# EAGLE schematic h bridge (EAGLE 9.6.2)

## Sheet 1 of 2
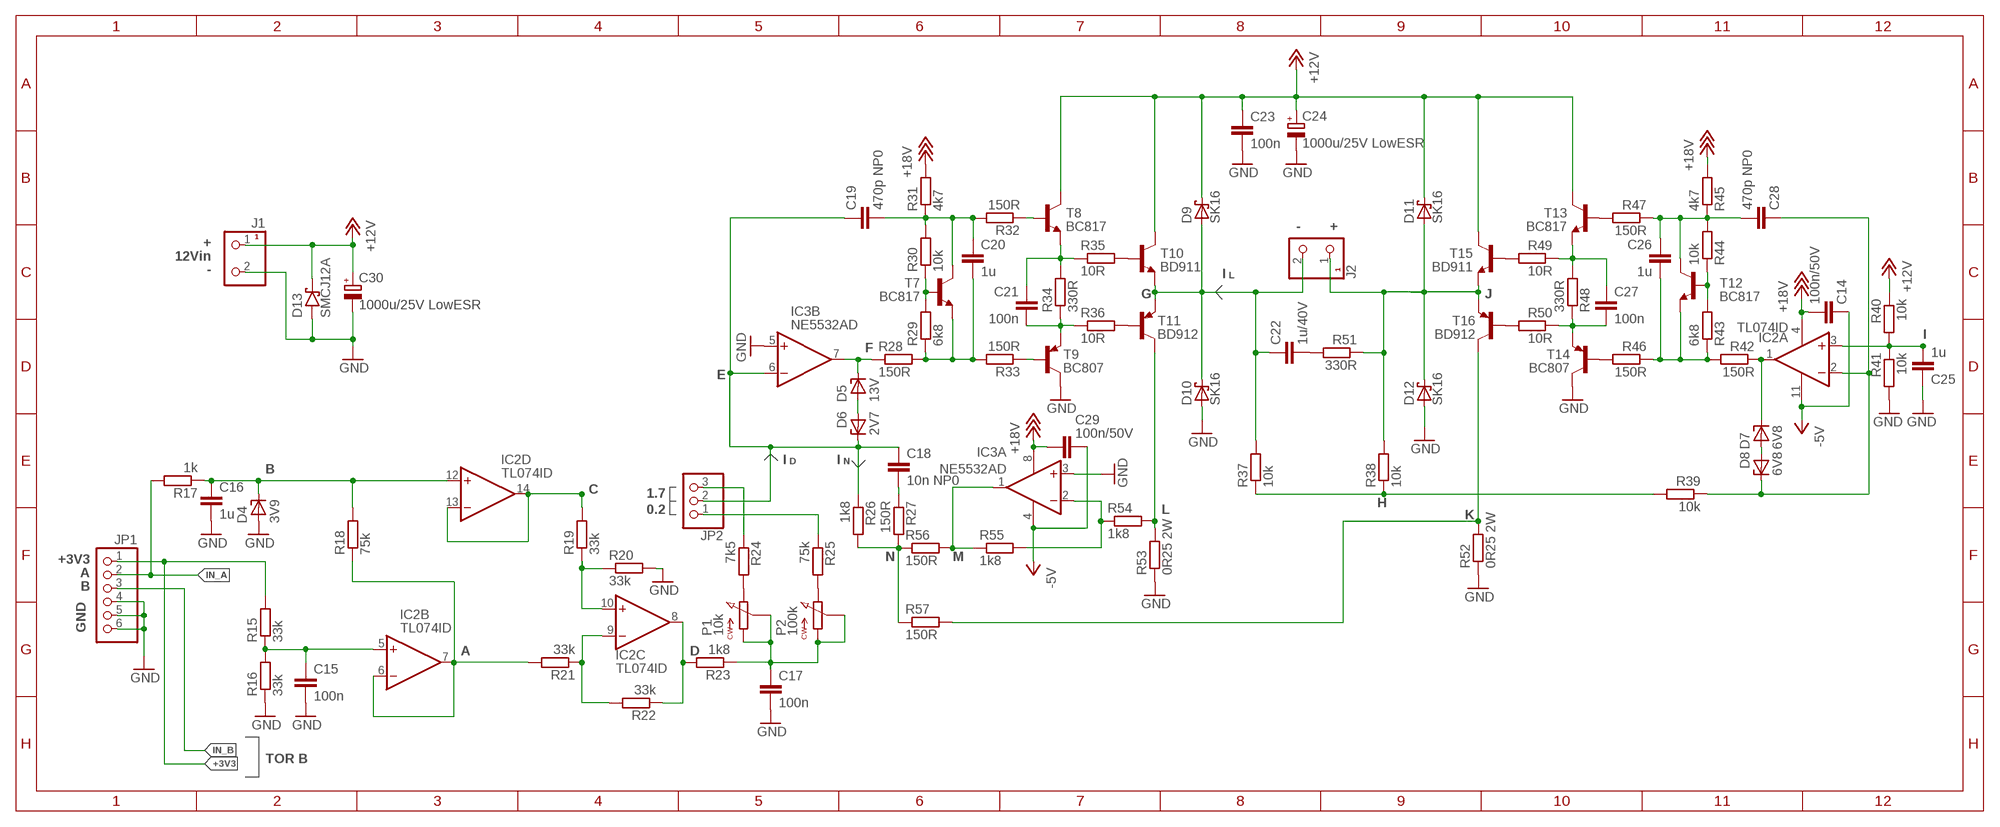
[diagram p0: schematic, sheet 1]

### Parts
C14  100n/50V  C-SMD-1206  [1206-SMD]
C15  100n  C-SMD-0805  [0805-SMD]
C16  1u  C-SMD-0805  [0805-SMD]
C17  100n  C-SMD-0805  [0805-SMD]
C18  10n NP0  C-SMD-0805  [0805-SMD]
C19  470p NP0  C-SMD-0805  [0805-SMD]
C20  1u  C-SMD-0805  [0805-SMD]
C21  100n  C-SMD-0805  [0805-SMD]
C22  1u/40V  C-THT-5MM-7.2X7.2  [FOIL-CAP-WIMA-7.2X7.2]
C23  100n  C-SMD-0805  [0805-SMD]
C24  1000u/25V LowESR  CPOL-THT-13MM  [CAP-THT-13MM-5MM]
C25  1u  C-SMD-0805  [0805-SMD]
C26  1u  C-SMD-0805  [0805-SMD]
C27  100n  C-SMD-0805  [0805-SMD]
C28  470p NP0  C-SMD-0805  [0805-SMD]
C29  100n/50V  C-SMD-1206  [1206-SMD]
C30  1000u/25V LowESR  CPOL-THT-13MM  [CAP-THT-13MM-5MM]
D4  3V9  DIODE-ZENER-SMD-MINI-MELF  [DIODE-MINI-MELF]
D5  13V  DIODE-ZENER-SMD-MINI-MELF  [DIODE-MINI-MELF]
D6  2V7  DIODE-ZENER-SMD-MINI-MELF  [DIODE-MINI-MELF]
D7  6V8  DIODE-ZENER-SMD-MINI-MELF  [DIODE-MINI-MELF]
D8  6V8  DIODE-ZENER-SMD-MINI-MELF  [DIODE-MINI-MELF]
D9  SK16  DIODE-SCHOTTKY-SMA  [DIODE-DO214AC-SMA-M]
D10  SK16  DIODE-SCHOTTKY-SMA  [DIODE-DO214AC-SMA-M]
D11  SK16  DIODE-SCHOTTKY-SMA  [DIODE-DO214AC-SMA-M]
D12  SK16  DIODE-SCHOTTKY-SMA  [DIODE-DO214AC-SMA-M]
D13  SMCJ12A  DIODE-TRANSIL-UNIDIR-SINGLE-SMC  [DIODE-DO214AB-SMC]
IC2  TL074ID  OPAMP_QUAD-SOIC14  [SOIC14-M]
IC3  NE5532AD  OPAMP_DUAL-SOIC8  [SOIC8-M]
J1  DEGSON DG301-5.0-2  ARK-2-THT-5.0MM-DG301  [ARK-2-DG301-5MM]
J2  DEGSON DG301-5.0-2  ARK-2-THT-5.0MM-DG301  [ARK-2-DG301-5MM]
JP1  CONNFLY DS1021-1*6SF1-1  PINHD-1X6  [1X06]
JP2  (1/2) CONNFLY DS1021-1*6SF1-1  PINHD-1X3  [1X03]
P1  10k  POT-THT-H  [POT-H]
P2  100k  POT-THT-H  [POT-H]
R15  33k  R-SMD-0805  [0805-SMD]
R16  33k  R-SMD-0805  [0805-SMD]
R17  1k  R-SMD-0805  [0805-SMD]
R18  75k  R-SMD-0805  [0805-SMD]
R19  33k  R-SMD-0805  [0805-SMD]
R20  33k  R-SMD-0805  [0805-SMD]
R21  33k  R-SMD-0805  [0805-SMD]
R22  33k  R-SMD-0805  [0805-SMD]
R23  1k8  R-SMD-0805  [0805-SMD]
R24  7k5  R-SMD-0805  [0805-SMD]
R25  75k  R-SMD-0805  [0805-SMD]
R26  1k8  R-SMD-0805  [0805-SMD]
R27  150R  R-SMD-0805  [0805-SMD]
R28  150R  R-SMD-0805  [0805-SMD]
R29  6k8  R-SMD-0805  [0805-SMD]
R30  10k  R-SMD-0805  [0805-SMD]
R31  4k7  R-SMD-0805  [0805-SMD]
R32  150R  R-SMD-0805  [0805-SMD]
R33  150R  R-SMD-0805  [0805-SMD]
R34  330R  R-SMD-0805  [0805-SMD]
R35  10R  R-SMD-0805  [0805-SMD]
R36  10R  R-SMD-0805  [0805-SMD]
R37  10k  R-SMD-0805  [0805-SMD]
R38  10k  R-SMD-0805  [0805-SMD]
R39  10k  R-SMD-0805  [0805-SMD]
R40  10k  R-SMD-0805  [0805-SMD]
R41  10k  R-SMD-0805  [0805-SMD]
R42  150R  R-SMD-0805  [0805-SMD]
R43  6k8  R-SMD-0805  [0805-SMD]
R44  10k  R-SMD-0805  [0805-SMD]
R45  4k7  R-SMD-0805  [0805-SMD]
R46  150R  R-SMD-0805  [0805-SMD]
R47  150R  R-SMD-0805  [0805-SMD]
R48  330R  R-SMD-0805  [0805-SMD]
R49  10R  R-SMD-0805  [0805-SMD]
R50  10R  R-SMD-0805  [0805-SMD]
R51  330R  R-SMD-0805  [0805-SMD]
R52  0R25 2W  R-SMD-2512  [2512-SMD]
R53  0R25 2W  R-SMD-2512  [2512-SMD]
R54  1k8  R-SMD-0805  [0805-SMD]
R55  1k8  R-SMD-0805  [0805-SMD]
R56  150R  R-SMD-0805  [0805-SMD]
R57  150R  R-SMD-0805  [0805-SMD]
T7  BC817  TRANSISTOR-NPN-SMD-SOT23  [SOT23]
T8  BC817  TRANSISTOR-NPN-SMD-SOT23  [SOT23]
T9  BC807  TRANSISTOR-PNP-SMD-SOT23  [SOT23]
T10  BD911  TRANSISTOR-NPN-SMD-SOT23  [SOT23]
T11  BD912  TRANSISTOR-PNP-SMD-SOT23  [SOT23]
T12  BC817  TRANSISTOR-NPN-SMD-SOT23  [SOT23]
T13  BC817  TRANSISTOR-NPN-SMD-SOT23  [SOT23]
T14  BC807  TRANSISTOR-PNP-SMD-SOT23  [SOT23]
T15  BD911  TRANSISTOR-NPN-SMD-SOT23  [SOT23]
T16  BD912  TRANSISTOR-PNP-SMD-SOT23  [SOT23]

### Nets
+3V3: JP1.1 R15.P$2
+12V: C23.P$1 C24.POS(+) C30.POS(+) D9.K(C) D11.K(C) D13.K(C) J1.1 R40.P$1 T10.3(C) T13.3(C) T15.3(C) ; also sheet 2
+18V: C14.P$2 C29.P$2 IC2.4(A:V+) IC3.8(A:V+) R31.P$2 R45.P$2 ; also sheet 2
-5V: C14.P$1 C29.P$1 IC2.11(A:V-) IC3.4(A:V-) ; also sheet 2
GND: C15.P$2 C16.P$2 C17.P$2 C23.P$2 C24.NEG(-) C25.P$1 C30.NEG(-) D4.A D10.A D12.A D13.A IC3.3(A:+IN) IC3.5(B:+IN) J1.2 JP1.4 JP1.5 JP1.6 R16.P$1 R20.P$2 R41.P$2 R52.P$1 R53.P$1 T9.3(C) T14.3(C) ; also sheet 2
IN_A: JP1.2 R17.P$2
IN_B: JP1.3
N$1: IC2.6(B:-IN) IC2.7(B:OUT) R18.P$1 R21.P$2
N$2: D11.A D12.K(C)
N$3: C18.P$1 C19.P$1 D6.K(C) IC3.6(B:-IN) JP2.2 R26.P$1
N$4: P1.CW R24.P$2
N$5: R47.P$2 T13.1(B)
N$6: R46.P$2 T14.1(B)
N$7: R33.P$1 T9.1(B)
N$8: R32.P$1 T8.1(B)
N$14: JP2.1 R25.P$1
N$15: JP2.3 R24.P$1
N$16: P2.CW R25.P$2
N$17: C22.P$2 R51.P$2
N$492: C15.P$1 IC2.5(B:+IN) R15.P$1 R16.P$2
N$493: C16.P$1 D4.K(C) IC2.12(D:+IN) R17.P$1 R18.P$2
N$496: IC2.13(D:-IN) IC2.14(D:OUT) R19.P$2
N$497: IC2.10(C:+IN) R19.P$1 R20.P$1
N$498: IC2.9(C:-IN) R21.P$1 R22.P$2
N$499: IC2.8(C:OUT) R22.P$1 R23.P$2
N$502: D5.K(C) IC3.7(B:OUT) R28.P$1
N$503: C21.P$1 R34.P$2 R35.P$1 T8.2(E)
N$504: C21.P$2 R34.P$1 R36.P$1 T9.2(E)
N$505: C20.P$2 R28.P$2 R33.P$2 T7.2(E)
N$506: R29.P$2 R30.P$1 T7.1(B)
N$507: T8.3(C)
N$508: R35.P$2 T10.1(B)
N$509: R36.P$2 T11.1(B)
N$510: C22.P$1 D9.A D10.K(C) J2.2 R37.P$2 T10.2(E) T11.2(E)
N$511: D7.K(C) IC2.1(A:OUT) R42.P$1
N$512: C27.P$1 R48.P$2 R49.P$1 T13.2(E)
N$513: C27.P$2 R48.P$1 R50.P$1 T14.2(E)
N$514: C26.P$2 R42.P$2 R43.P$1 R46.P$1 T12.2(E)
N$515: C26.P$1 C28.P$2 R44.P$2 R45.P$1 R47.P$1 T12.3(C)
N$516: R43.P$2 R44.P$1 T12.1(B)
N$517: R49.P$2 T15.1(B)
N$518: R50.P$2 T16.1(B)
N$519: J2.1 R38.P$2 R51.P$1 T15.2(E) T16.2(E)
N$520: C25.P$2 IC2.3(A:+IN) R40.P$2 R41.P$1
N$521: C28.P$1 D8.K(C) IC2.2(A:-IN) R39.P$1
N$522: R53.P$2 R54.P$2 T11.3(C)
N$523: R52.P$2 R57.P$2 T16.3(C)
N$524: IC3.2(A:-IN) R54.P$1 R55.P$2
N$525: IC3.1(A:OUT) R55.P$1 R56.P$2
N$526: R26.P$2 R27.P$2 R56.P$1 R57.P$1
N$527: R37.P$1 R38.P$1 R39.P$2
N$530: C19.P$2 C20.P$1 R30.P$2 R31.P$1 R32.P$2 T7.3(C)
N$531: R29.P$1
N$532: C18.P$2 R27.P$1
N$535: C17.P$1 P1.CCW P1.W P2.CCW P2.W R23.P$1
N$538: D5.A D6.A
N$539: D7.A D8.A

### Notes on the sheet
- - | +
- +
- 12Vin
- -
- I | L
- G | J
- I
- F
- E
- I | D | I | N
- B
- 1.7
- C
- 0.2 | H
- L
- K
- +3V3
- N | M
- A
- B
- GND
- A | D
- TOR B

## Sheet 2 of 2
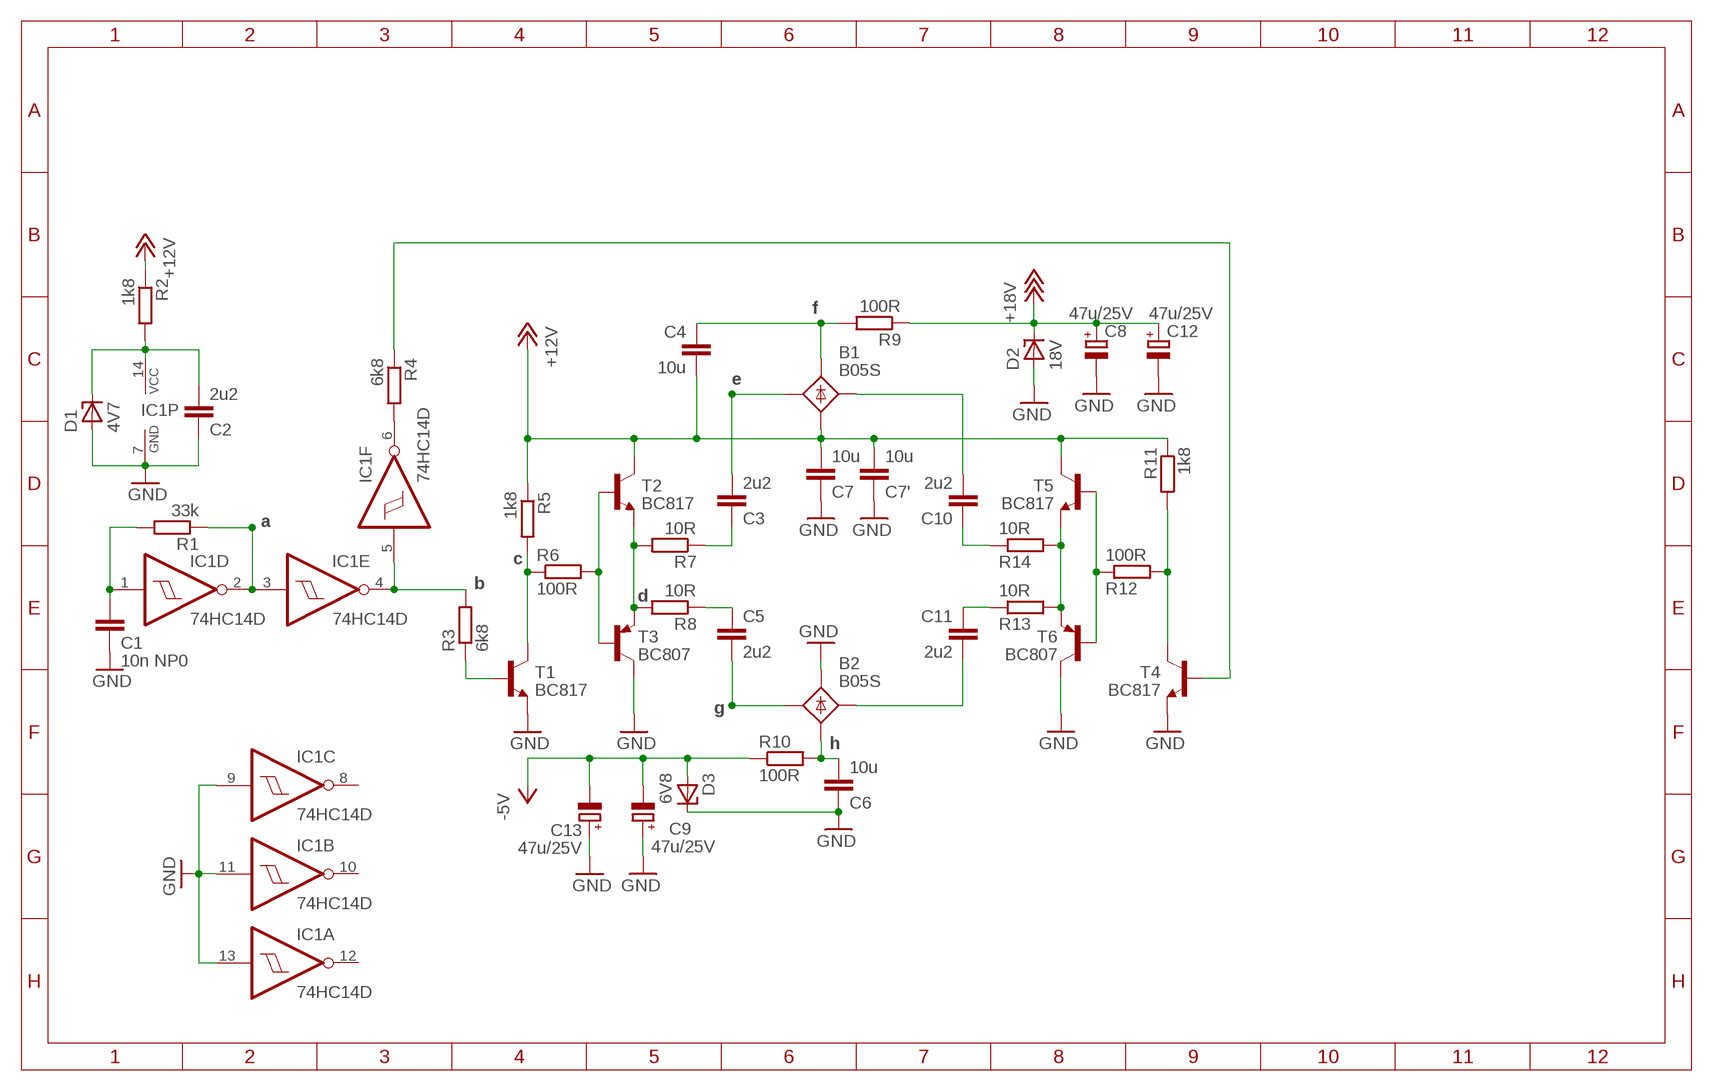
[diagram p1: schematic, sheet 2]

### Parts
B1  B05S  RECTIFIER-DB-1MS  [BRIDGE_DB-1MS]
B2  B05S  RECTIFIER-DB-1MS  [BRIDGE_DB-1MS]
C1  10n NP0  C-SMD-0805  [0805-SMD]
C2  2u2  C-SMD-0805  [0805-SMD]
C3  2u2  C-SMD-0805  [0805-SMD]
C4  10u  C-SMD-0805  [0805-SMD]
C5  2u2  C-SMD-0805  [0805-SMD]
C6  10u  C-SMD-0805  [0805-SMD]
C7  10u  C-SMD-0805  [0805-SMD]
C7'  10u  C-SMD-0805  [0805-SMD]
C8  47u/25V  CPOL-THT-6.3MM  [CAP-THT-6MM-2.5MM]
C9  47u/25V  CPOL-THT-6.3MM  [CAP-THT-6MM-2.5MM]
C10  2u2  C-SMD-0805  [0805-SMD]
C11  2u2  C-SMD-0805  [0805-SMD]
C12  47u/25V  CPOL-THT-6.3MM  [CAP-THT-6MM-2.5MM]
C13  47u/25V  CPOL-THT-6.3MM  [CAP-THT-6MM-2.5MM]
D1  4V7  DIODE-ZENER-SMD-MINI-MELF  [DIODE-MINI-MELF]
D2  18V  DIODE-ZENER-SMD-MINI-MELF  [DIODE-MINI-MELF]
D3  6V8  DIODE-ZENER-SMD-MINI-MELF  [DIODE-MINI-MELF]
IC1  74HC14D  [SO14]
R1  33k  R-SMD-0805  [0805-SMD]
R2  1k8  R-SMD-0805  [0805-SMD]
R3  6k8  R-SMD-0805  [0805-SMD]
R4  6k8  R-SMD-0805  [0805-SMD]
R5  1k8  R-SMD-0805  [0805-SMD]
R6  100R  R-SMD-0805  [0805-SMD]
R7  10R  R-SMD-0805  [0805-SMD]
R8  10R  R-SMD-0805  [0805-SMD]
R9  100R  R-SMD-0805  [0805-SMD]
R10  100R  R-SMD-0805  [0805-SMD]
R11  1k8  R-SMD-0805  [0805-SMD]
R12  100R  R-SMD-0805  [0805-SMD]
R13  10R  R-SMD-0805  [0805-SMD]
R14  10R  R-SMD-0805  [0805-SMD]
T1  BC817  TRANSISTOR-NPN-SMD-SOT23  [SOT23]
T2  BC817  TRANSISTOR-NPN-SMD-SOT23  [SOT23]
T3  BC807  TRANSISTOR-PNP-SMD-SOT23  [SOT23]
T4  BC817  TRANSISTOR-NPN-SMD-SOT23  [SOT23]
T5  BC817  TRANSISTOR-NPN-SMD-SOT23  [SOT23]
T6  BC807  TRANSISTOR-PNP-SMD-SOT23  [SOT23]

### Nets
+12V: B1.NEG(-) C4.P$2 C7'.P$2 C7.P$2 R2.P$1 R5.P$1 R11.P$1 T2.3(C) T5.3(C) ; also sheet 1
+18V: C8.POS(+) C12.POS(+) D2.K(C) R9.P$1 ; also sheet 1
-5V: C9.NEG(-) C13.NEG(-) D3.A R10.P$1 ; also sheet 1
GND: B2.POS(+) C1.P$2 C2.P$1 C6.P$1 C7'.P$1 C7.P$1 C8.NEG(-) C9.POS(+) C12.NEG(-) C13.POS(+) D1.A D2.A D3.K(C) IC1.7(P:GND) IC1.9(C:I) IC1.11(B:I) IC1.13(A:I) T1.2(E) T3.3(C) T4.2(E) T6.3(C) ; also sheet 1
N$9: R5.P$2 R6.P$1 T1.3(C)
N$10: R12.P$1 T5.1(B) T6.1(B)
N$11: IC1.2(D:O) IC1.3(E:I) R1.P$1
N$12: IC1.6(F:O) R4.P$2
N$13: IC1.4(E:O) IC1.5(F:I) R3.P$2
N$541: C1.P$1 IC1.1(D:I) R1.P$2
N$543: R3.P$1 T1.1(B)
N$544: R7.P$2 R8.P$2 T2.2(E) T3.2(E)
N$545: C5.P$1 R8.P$1
N$546: C3.P$1 R7.P$1
N$547: B1.AC1 C3.P$2
N$548: T4.1(B)
N$549: R11.P$2 R12.P$2 T4.3(C)
N$550: R13.P$2 R14.P$2 T5.2(E) T6.2(E)
N$551: C11.P$1 R13.P$1
N$552: C10.P$1 R14.P$1
N$553: B1.AC2 C10.P$2
N$554: B2.AC1 C5.P$2
N$555: B2.AC2 C11.P$2
N$556: B2.NEG(-) C6.P$2 R10.P$2
N$557: B1.POS(+) C4.P$1 R9.P$2
N$558: R4.P$1
N$559: R6.P$2 T2.1(B) T3.1(B)
N$560: C2.P$2 D1.K(C) IC1.14(P:VCC) R2.P$2
Unconnected: IC1.8(C:O) IC1.10(B:O) IC1.12(A:O)

### Notes on the sheet
- f
- e
- a
- c
- b
- d
- g
- h

## Library data of the parts
B1 B2 = Moja2:RECTIFIER: Rectifier, 1 phase
C1-C7 C7' C10 C11 C14-C23 C25-C29 = Moja2:C
C8 C9 C12 C13 C24 C30 = Moja2:CPOL
D1-D8 = Moja2:DIODE-ZENER
D9-D12 = Moja2:DIODE-SCHOTTKY
D13 = Moja2:DIODE-TRANSIL-UNIDIR-SINGLE: General Transil diode
IC1 = 74xx-eu:74*14: Hex schmitt trigger INVERTER
IC2 = Moja2:OPAMP_QUAD
IC3 = Moja2:OPAMP_DUAL
J1 J2 = Moja2:ARK-2
JP1 = pinhead:PINHD-1X6: PIN HEADER
JP2 = pinhead:PINHD-1X3: PIN HEADER
P1 P2 = Moja2:POT
R1-R57 = Moja2:R
T1 T2 T4 T5 T7 T8 T10 T12 T13 T15 = Moja2:TRANSISTOR-NPN
T3 T6 T9 T11 T14 T16 = Moja2:TRANSISTOR-PNP